# EAGLE schematic schematic (EAGLE 8.4.1)
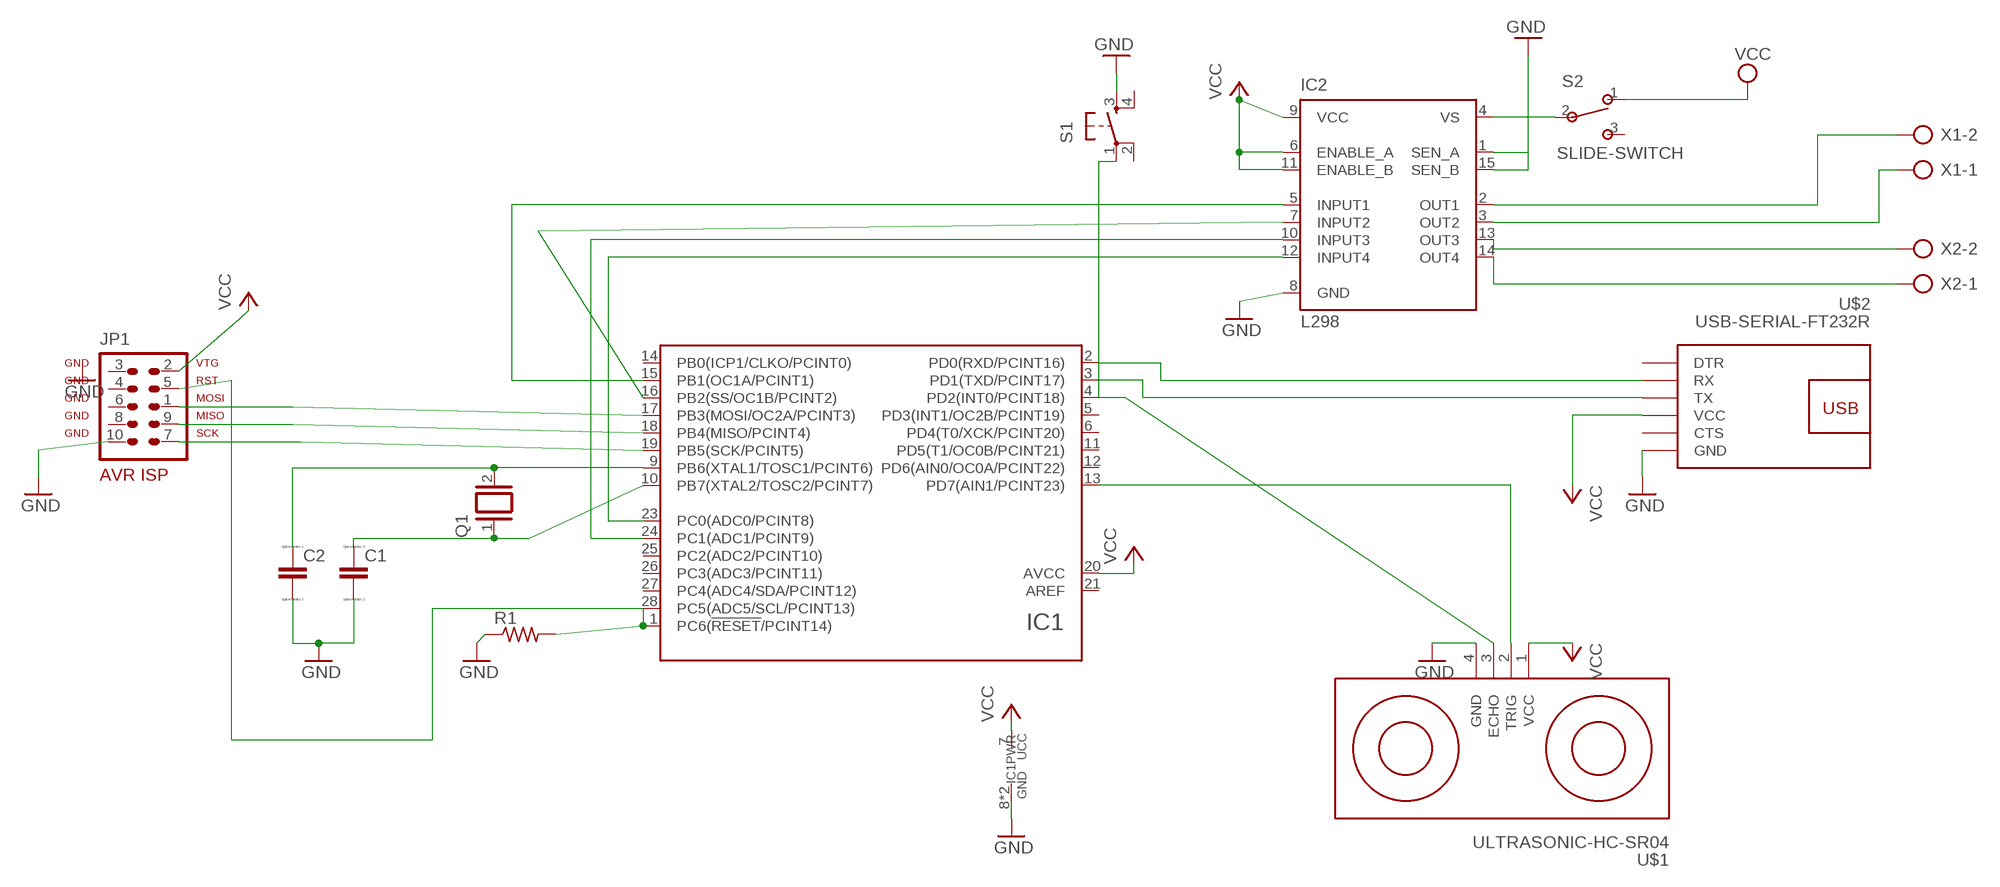
[diagram p0: schematic, sheet 1]

## Parts
C1  C  [C0805]
C2  C  [C0805]
IC1  ATMEGA48/88/168/328-PU(DIP28)PU  [DIL28]
IC2  L298  [MULTIWATT-15]
JP1  AVR-ISP-10  [AVR-ISP-10]
Q1  XTAL/S  [QS]
R1  R-US_0207/10  [0207/10]
S1  6MM_SWITCH6MM_SWITCH  [6MM_SWITCH]
S2  SLIDE-SWITCH  [AYZ0102AGRLC]
U$1  ULTRASONIC-HC-SR04  [ULTRASONIC-HC-SR04]
U$2  USB-SERIAL-FT232R  [USB-SERIAL-FT232R]
X1  AK500/2  [AK500/2]
X2  AK500/2  [AK500/2]

## Nets
GND: C1.2 IC1.8(GND) IC1.22(GND) IC2.1(SEN_A) IC2.8(GND) IC2.15(SEN_B) JP1.10 R1.1 S1.3(S) U$1.4(GND) U$2.6(GND)
N$1: IC1.17(PB3(MOSI/OC2A/PCINT3)) JP1.1
N$2: IC1.18(PB4(MISO/PCINT4)) JP1.9
N$3: IC1.19(PB5(SCK/PCINT5)) JP1.7
N$4: IC1.1(PC6(!RESET!/PCINT14)) JP1.5 R1.2
N$5: C2.1 IC1.9(PB6(XTAL1/TOSC1/PCINT6)) Q1.2
N$6: C1.1 IC1.10(PB7(XTAL2/TOSC2/PCINT7)) Q1.1
N$7: IC1.15(PB1(OC1A/PCINT1)) IC2.5(INPUT1)
N$8: IC1.16(PB2(SS/OC1B/PCINT2)) IC2.7(INPUT2)
N$9: IC1.24(PC1(ADC1/PCINT9)) IC2.10(INPUT3)
N$10: IC1.13(PD7(AIN1/PCINT23)) U$1.2(TRIG)
N$11: IC1.4(PD2(INT0/PCINT18)) S1.1(P) U$1.3(ECHO)
N$12: IC1.3(PD1(TXD/PCINT17)) U$2.3(TX)
N$13: IC1.2(PD0(RXD/PCINT16)) U$2.2(RX)
N$14: IC2.4(VS) S2.2
N$16: IC1.23(PC0(ADC0/PCINT8)) IC2.12(INPUT4)
N$17: IC2.2(OUT1) X1.2
N$18: IC2.3(OUT2) X1.1
N$19: IC2.13(OUT3) X2.2
N$20: IC2.14(OUT4) X2.1
VCC: IC1.7(UCC) IC1.20(AVCC) IC2.6(ENABLE_A) IC2.9(VCC) IC2.11(ENABLE_B) JP1.2 S2.1 U$1.1(VCC) U$2.4(VCC)
Unconnected: C2.2 IC1.5(PD3(INT1/OC2B/PCINT19)) IC1.6(PD4(T0/XCK/PCINT20)) IC1.11(PD5(T1/OC0B/PCINT21)) IC1.12(PD6(AIN0/OC0A/PCINT22)) IC1.14(PB0(ICP1/CLKO/PCINT0)) IC1.21(AREF) IC1.25(PC2(ADC2/PCINT10)) IC1.26(PC3(ADC3/PCINT11)) IC1.27(PC4(ADC4/SDA/PCINT12)) IC1.28(PC5(ADC5/SCL/PCINT13)) JP1.3 JP1.4 JP1.6 JP1.8 S1.2(P1) S1.4(S1) S2.3 U$2.1(DTR) U$2.5(CTS)

## Library data of the parts
C1 C2 = eagle-ltspice:C: CAPACITOR, European symbol; SPICEMODEL: NONE; SPICEPREFIX: C
IC1 = atmel_tiny24-44-84tiny48-88mega48-88-168-328:ATMEGA48/88/168/328-PU(DIP28)
IC2 = st-microelectronics:L298: DUAL FULL-BRIDGE DRIVER; MPN: L298N; OC_FARNELL: 1589425; OC_NEWARK: 32M1527
JP1 = atmel:AVR-ISP-10: AVR ISP-10 Serial Programming Header
Q1 = special:XTAL/S: CRYSTAL
R1 = rcl:R-US_: RESISTOR, American symbol
S1 = fab:6MM_SWITCH: OMRON SWITCH
S2 = fab:SLIDE-SWITCH: SMD slide-switch AYZ0102AGRLC as found in the fablab inventory. Includes the mounting holes. Made by Zaerc.
U$1 = diy-modules:ULTRASONIC-HC-SR04: Ultrasonic Ranging Module HC-SR04 More details available here: http://randomnerdtutorials.com/complete-guide-for-ultrasonic-sensor-hc-sr04/ Click here to find device on ebay.com <http://www.ebay.com/sch/hc+sr04+ultrasonic>
U$2 = diy-modules:USB-SERIAL-FT232R: USB to Serial UART Converter based on FT232R chip More information about FT232R chip is available here: http://www.ftdichip.com/Products/ICs/FT232R.htm Click here to find device on ebay.com <http://www.ebay.com/sch/ft232rl+arduino+download+max232>
X1 X2 = con-ptr500:AK500/2: CONNECTOR; OC_FARNELL: unknown; OC_NEWARK: unknown